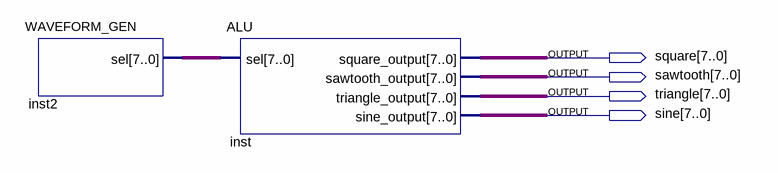
[diagram p0: schematic sheet]
// Quartus schematic tb_top.bdf as structural Verilog: 2 symbols, 4 pins
module tb_top (
  output [7:0] square,
  output [7:0] sawtooth,
  output [7:0] triangle,
  output [7:0] sine
);

  wire [7:0] inst2_sel;

  WAVEFORM_GEN inst2 (.sel(inst2_sel));
  ALU inst (
    .sel(inst2_sel), .square_output(square), .sawtooth_output(sawtooth), .triangle_output(triangle),
    .sine_output(sine));
endmodule
